# Altium schematic sheet BMS Schematic.SchDoc
size A4; DocumentNumber: 1; SheetNumber: 1; SheetTotal: 4
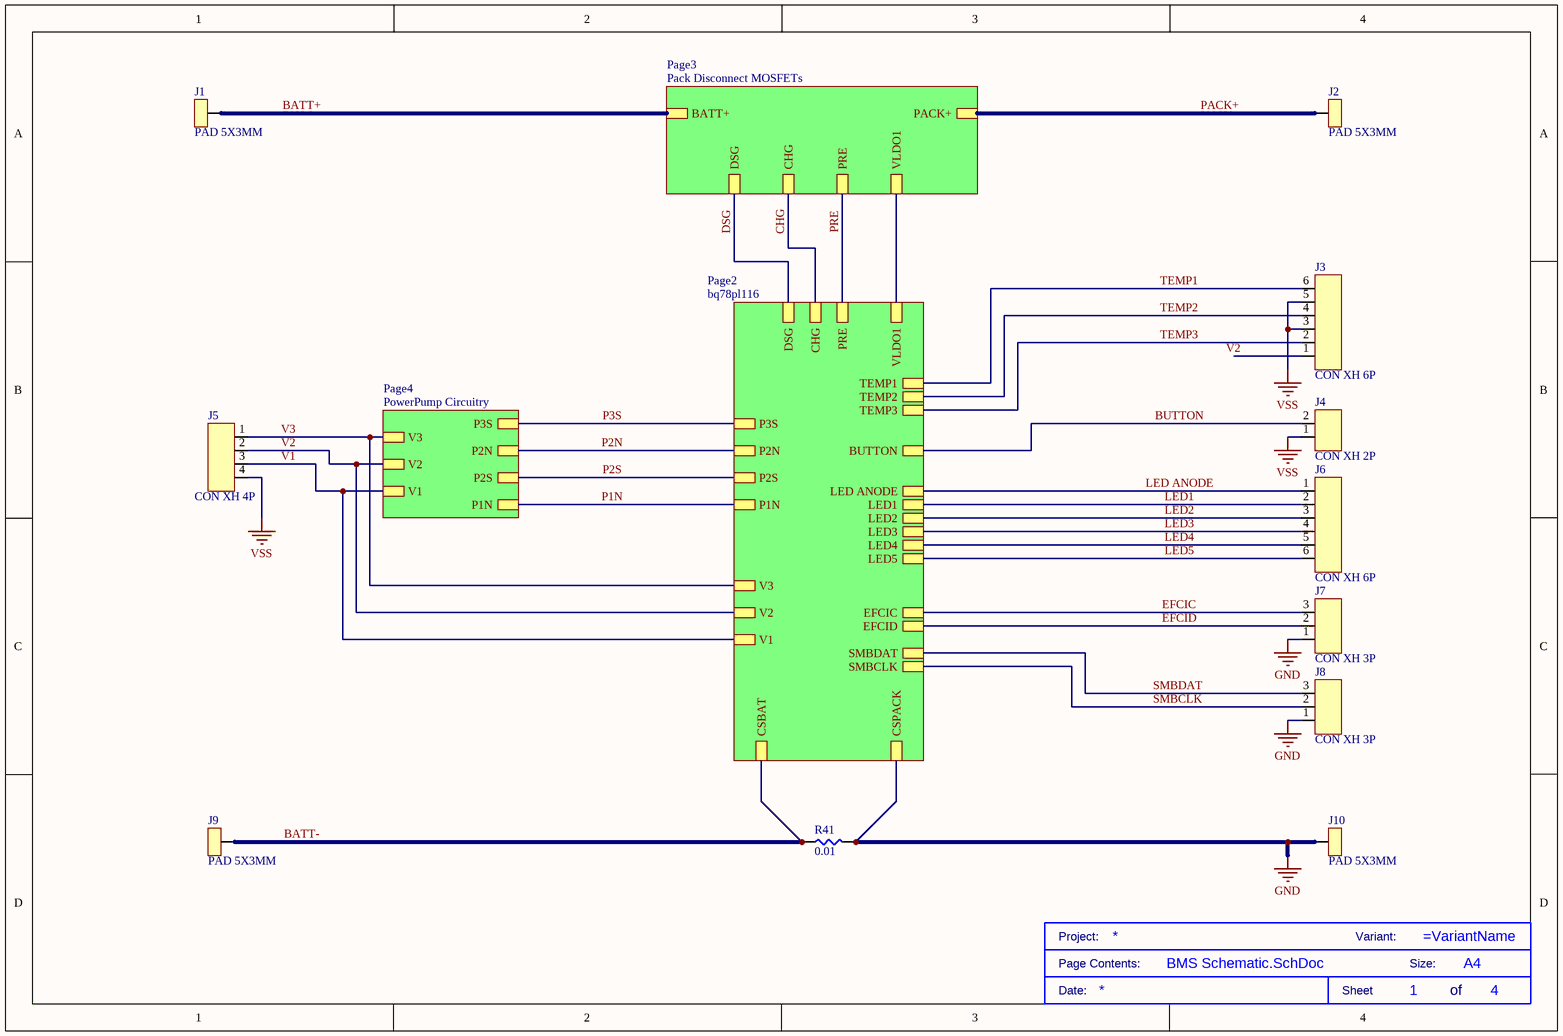
[diagram p0: BMS Schematic.SchDoc]

## Parts
*  Size: A4  (hidden comment: TITLE BLOCK)  (graphical)
J1  PAD 5X3MM  [PAD 5X3MM]
J2  PAD 5X3MM  [PAD 5X3MM]
J3  CON XH 6P  [XH 2.5 6P]
J4  CON XH 2P  [XH 2.5 2P]
J5  CON XH 4P  [XH 2.5 4P]
J6  CON XH 6P  [XH 2.5 6P]
J7  CON XH 3P  [XH 2.5 3P]
J8  CON XH 3P  [XH 2.5 3P]
J9  PAD 5X3MM  [PAD 5X3MM]
J10  PAD 5X3MM  [PAD 5X3MM]
R41  0.01  [RSHUNT]

## Sub-sheets
Page2 = bq78pl116: DSG, PRE, TEMP3, CHG, LED5, VLDO1, TEMP2, V2, LED3, BUTTON, LED4, LED1, LED2, SMBCLK, P1N, CSBAT, P2S, P2N, P3S, V1, V3, EFCID, EFCIC, LED ANODE, CSPACK, SMBDAT, TEMP1
Page3 = Pack Disconnect MOSFETs: VLDO1, DSG, CHG, BATT+, PRE, PACK+
Page4 = PowerPump Circuitry: P2N, P3S, P2S, P1N, V2, V3, V1

## Nets
GND: J7.1 J8.1 J10.1 R41.2 ; sheet Page2/CSPACK
VSS: J3.3 J3.5 J4.1 J5.4
BATT+: J1.1 ; sheet Page3/BATT+
BATT-: J9.1 R41.1 ; sheet Page2/CSBAT
BUTTON: J4.2 ; sheet Page2/BUTTON
CHG: sheet Page3/CHG, sheet Page2/CHG
DSG: sheet Page3/DSG, sheet Page2/DSG
EFCIC: J7.3 ; sheet Page2/EFCIC
EFCID: J7.2 ; sheet Page2/EFCID
LED1: J6.2 ; sheet Page2/LED1
LED2: J6.3 ; sheet Page2/LED2
LED3: J6.4 ; sheet Page2/LED3
LED4: J6.5 ; sheet Page2/LED4
LED5: J6.6 ; sheet Page2/LED5
LED ANODE: J6.1 ; sheet Page2/LED ANODE
P1N: sheet Page4/P1N, sheet Page2/P1N
P2N: sheet Page4/P2N, sheet Page2/P2N
P2S: sheet Page4/P2S, sheet Page2/P2S
P3S: sheet Page4/P3S, sheet Page2/P3S
PACK+: J2.1 ; sheet Page3/PACK+
PRE: sheet Page3/PRE, sheet Page2/PRE
SMBCLK: J8.2 ; sheet Page2/SMBCLK
SMBDAT: J8.3 ; sheet Page2/SMBDAT
TEMP1: J3.6 ; sheet Page2/TEMP1
TEMP2: J3.4 ; sheet Page2/TEMP2
TEMP3: J3.2 ; sheet Page2/TEMP3
V1: J5.3 ; sheet Page4/V1, sheet Page2/V1
V2: J3.1 J5.2 ; sheet Page4/V2, sheet Page2/V2
V3: J5.1 ; sheet Page4/V3, sheet Page2/V3
(unnamed): sheet Page3/VLDO1, sheet Page2/VLDO1

## Notes on the sheet
- (in symbol TITLE BLOCK) Project:; Variant:; Page Contents:; Size:; Date:; Sheet; of

## Library data of the parts
J3 J6 = CONN XH 2.5 6P: CONN HEADER VERT 6POS 2.5MM; Manufacturer: JST; Manufacturer Part Number: B6BXHA(LF)(SN); Supplier 1: Distrelec; RoHS: Yes; Category: FFC / FPC; ComponentLink1URL: https://datasheet.ciiva.com/26894/getdatasheetpartid-424647-26894806.pdf?src-supplier=Verical; ComponentLink1Description: https://datasheet.ciiva.com/26894/getdatasheetpartid-424647-26894806.pdf?src-supplier=Verical; ComponentLink2URL: https://datasheet.ciiva.com/26894/getdatasheetpartid-641012-26894489.pdf?src-supplier=Verical; ComponentLink2Description: https://datasheet.ciiva.com/26894/getdatasheetpartid-641012-26894489.pdf?src-supplier=Verical; ComponentLink3URL: https://datasheet.ciiva.com/712/exh-712511.pdf?src-supplier=Digi-Key; ComponentLink3Description: https://datasheet.ciiva.com/712/exh-712511.pdf?src-supplier=Digi-Key; ComponentLink4URL: https://datasheet.ciiva.com/16397/b6b-xh-alfsn-16397116.pdf?src-supplier=Future+Electronics; ComponentLink4Description: https://datasheet.ciiva.com/16397/b6b-xh-alfsn-16397116.pdf?src-supplier=Future+Electronics; Supplier Part Number 1: 14301998
J4 = CONN XH 2.5 2P: 2 Position Dual Row 2.5 mm Pitch Through Hole Shrouded Header; Manufacturer: JST; Manufacturer Part Number: B2B-XH-A-GU; Supplier 1: Digi-Key; RoHS: Yes; Category: Headers and Wire Housings; Stock 1: 22513; Pricing 1: 1=0,24000, 10=0,20400, 100=0,15680, 500=0,13270, 1000=0,10858, 5000=0,09652, 10000=0,08747 (USD); ComponentLink1URL: https://datasheet.ciiva.com/16417/exh-16417678.pdf?src-supplier=Future+Electronics; ComponentLink1Description: https://datasheet.ciiva.com/16417/exh-16417678.pdf?src-supplier=Future+Electronics; Supplier Part Number 1: 455-2946-ND
J5 = CONN XH 2.5 4P: XH Series 4 Position 2.5 mm Pitch Through Hole Crimp Top Entry Shrouded Header; Manufacturer: JST; Manufacturer Part Number: B4B-XH-A(LF)(SN); Supplier 1: RSComponents; RoHS: Yes; Category: FFC / FPC; Stock 1: 10520; Pricing 1: 5=0,42800, 125=0,15600, 500=0,14600, 1250=0,13600, 2500=0,12800 (GBP); ComponentLink1URL: https://datasheet.ciiva.com/16203/b4b-xh-alfsn-16203642.pdf?src-supplier=Future+Electronics; ComponentLink1Description: https://datasheet.ciiva.com/16203/b4b-xh-alfsn-16203642.pdf?src-supplier=Future+Electronics; ComponentLink2URL: https://datasheet.ciiva.com/26924/getdatasheetpartid-640571-26924035.pdf?src-supplier=Verical; ComponentLink2Description: https://datasheet.ciiva.com/26924/getdatasheetpartid-640571-26924035.pdf?src-supplier=Verical; ComponentLink3URL: https://datasheet.ciiva.com/26894/getdatasheetpartid-455616-26894787.pdf?src-supplier=Verical; ComponentLink3Description: https://datasheet.ciiva.com/26894/getdatasheetpartid-455616-26894787.pdf?src-supplier=Verical; ComponentLink4URL: https://datasheet.ciiva.com/726/exh-726404.pdf?src-supplier=Digi-Key; ComponentLink4Description: https://datasheet.ciiva.com/726/exh-726404.pdf?src-supplier=Digi-Key; Supplier Part Number 1: 8201551
J7 J8 = CONN XH 2.5 3P: Connector Header, XH Series, 3 Position, 2.50mm, Through Hole, Press-Fit, Solder, Natural; Manufacturer: JST; Manufacturer Part Number: B3B-XH-A(LF)(SN); Supplier 1: RSComponents; RoHS: Yes; Category: Headers and Wire Housings; Stock 1: 43000; Pricing 1: 1000=0,07100 (GBP); ComponentLink1URL: https://datasheet.ciiva.com/26894/getdatasheetpartid-640434-26894454.pdf?src-supplier=Verical; ComponentLink1Description: https://datasheet.ciiva.com/26894/getdatasheetpartid-640434-26894454.pdf?src-supplier=Verical; ComponentLink2URL: https://datasheet.ciiva.com/26894/getdatasheetpartid-440399-26894778.pdf?src-supplier=Verical; ComponentLink2Description: https://datasheet.ciiva.com/26894/getdatasheetpartid-440399-26894778.pdf?src-supplier=Verical; ComponentLink3URL: https://datasheet.ciiva.com/11746/0900766b8082653f-11746520.pdf?src-supplier=RSComponents; ComponentLink3Description: https://datasheet.ciiva.com/11746/0900766b8082653f-11746520.pdf?src-supplier=RSComponents; Supplier Part Number 1: 1724888
R41 = SHUNT 10m